# EAGLE design miniframeV3STABLE (EAGLE 5.10)
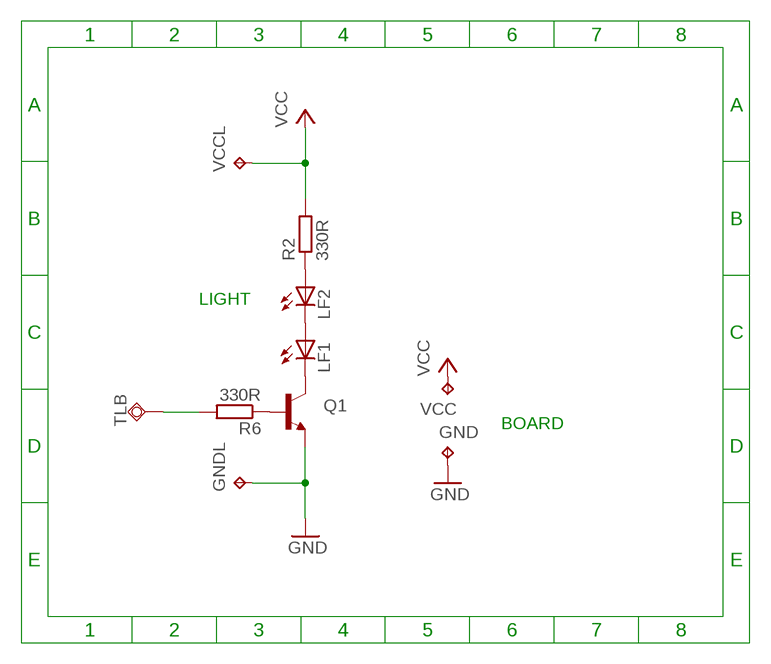
[diagram p0: schematic, sheet 1]

## Parts
GND  TPTP20SQ  [TP20SQ]
GNDL  TPTP20SQ  [TP20SQ]
LF1  LEDCHIPLED_1206  [CHIPLED_1206]
LF2  LEDCHIPLED_1206  [CHIPLED_1206]
Q1  TRANSISTOR_NPNSOT23-3  [SOT23-3]
R2  330R  R-EU_R0805  [R0805]
R6  330R  R-EU_R0805  [R0805]
TLB  TPSQTP19SQ  [TP19SQ]
VCC  TPTP20SQ  [TP20SQ]
VCCL  TPTP20SQ  [TP20SQ]

## Nets
GND: GND.TP GNDL.TP Q1.2(E)
N$1: R6.2 TLB.TP
N$4: LF1.A LF2.C
N$5: LF1.C Q1.3(C)
N$6: LF2.A R2.1
N$7: Q1.1(B) R6.1
VCC: R2.2 VCC.TP VCCL.TP

## Notes on the sheet
- LIGHT
- BOARD

## Library data of the parts
GND GNDL VCC VCCL = testpad:TP: Test pad
LF1 LF2 = led:LED: LED OSRAM: - CHIPLED LG R971, LG N971, LY N971, LG Q971, LY Q971, LO R971, LY R971 LH N974, LH R974 LS Q976, LO Q976, LY Q976 LO Q996 - Hyper CHIPLED LW Q18S LB Q993, LB Q99A, LB R99A - SideLED LS A670, LO A670, LY A670, LG A670, LP A670 LB A673, LV A673, LT A673, LW A673 LH A674 LY A675 LS A676, LA A676, LO A676, LY A676, LW A676 LS A679, LY A679, LG A679 - Hyper Micro SIDELED® LS Y876, LA Y876, LO Y876, LY Y876 LT Y87S - SmartLED LW L88C, LW L88S LB L89C, LB L89S, LG L890 LS L89K, LO L89K, LY L89K LS L896, LA L896, LO L896, LY L896 - TOPLED LS T670, LO T670, LY T670, LG T670, LP T670 LSG T670, LSP T670, LSY T670, LOP T670, LYG T670 LG T671, LOG T671, LSG T671 LB T673, LV T673, LT T673, LW T673 LH T674 LS T676, LA T676, LO T676, LY T676, LB T676, LH T676, LSB T676, LW T676 LB T67C, LV T67C, LT T67C, LS T67K, LO T67K, LY T67K, LW E67C LS E67B, LA E67B, LO E67B, LY E67B, LB E67C, LV E67C, LT E67C LW T67C LS T679, LY T679, LG T679 LS T770, LO T770, LY T770, LG T770, LP T770 LB T773, LV T773, LT T773, LW T773 LH T774 LS E675, LA E675, LY E675, LS T675 LS T776, LA T776, LO T776, LY T776, LB T776 LHGB T686 LT T68C, LB T68C - Hyper Mini TOPLED® LB M676 - Mini TOPLED Santana® LG M470 LS M47K, LO M47K, LY M47K Source: http://www.osram.convergy.de LUXEON: - LUMILED® LXK2-PW12-R00, LXK2-PW12-S00, LXK2-PW14-U00, LXK2-PW14-V00 LXK2-PM12-R00, LXK2-PM12-S00, LXK2-PM14-U00 LXK2-PE12-Q00, LXK2-PE12-R00, LXK2-PE12-S00, LXK2-PE14-T00, LXK2-PE14-U00 LXK2-PB12-K00, LXK2-PB12-L00, LXK2-PB12-M00, LXK2-PB14-N00, LXK2-PB14-P00, LXK2-PB14-Q00 LXK2-PR12-L00, LXK2-PR12-M00, LXK2-PR14-Q00, LXK2-PR14-R00 LXK2-PD12-Q00, LXK2-PD12-R00, LXK2-PD12-S00 LXK2-PH12-R00, LXK2-PH12-S00 LXK2-PL12-P00, LXK2-PL12-Q00, LXK2-PL12-R00 Source: www.luxeon.com KINGBRIGHT: KA-3528ASYC Source: www.kingbright.com
Q1 = SparkFun:TRANSISTOR_NPN: Transistor NPN BJT configuration in SOT23 package. MMBT2222 is the common NPN we use. Double check BCE configuration again layout.
R2 R6 = rcl:R-EU_: RESISTOR, European symbol
TLB = testpad:TPSQ: Test pad

## Board
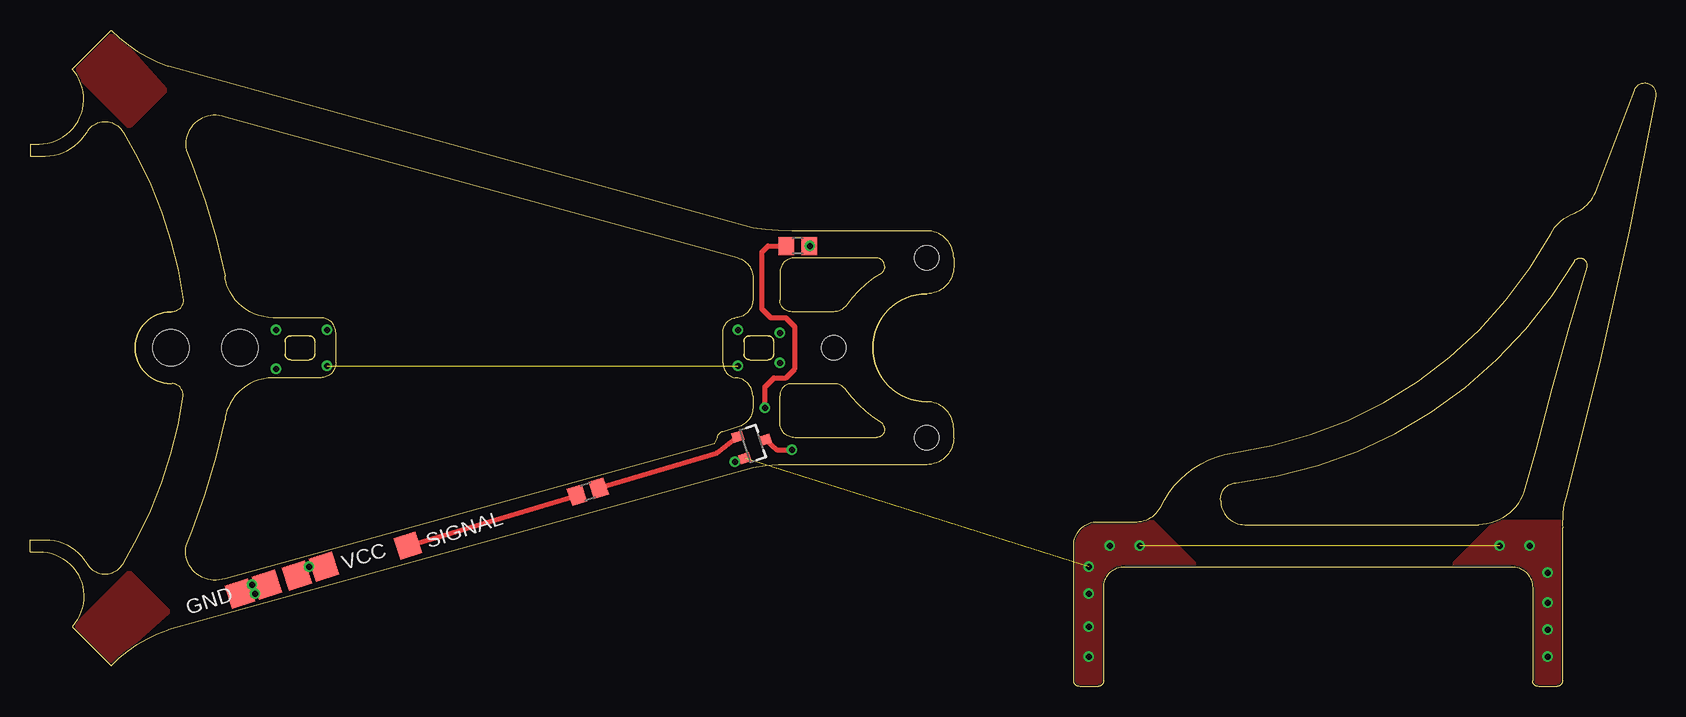
[diagram p1: board, top side]
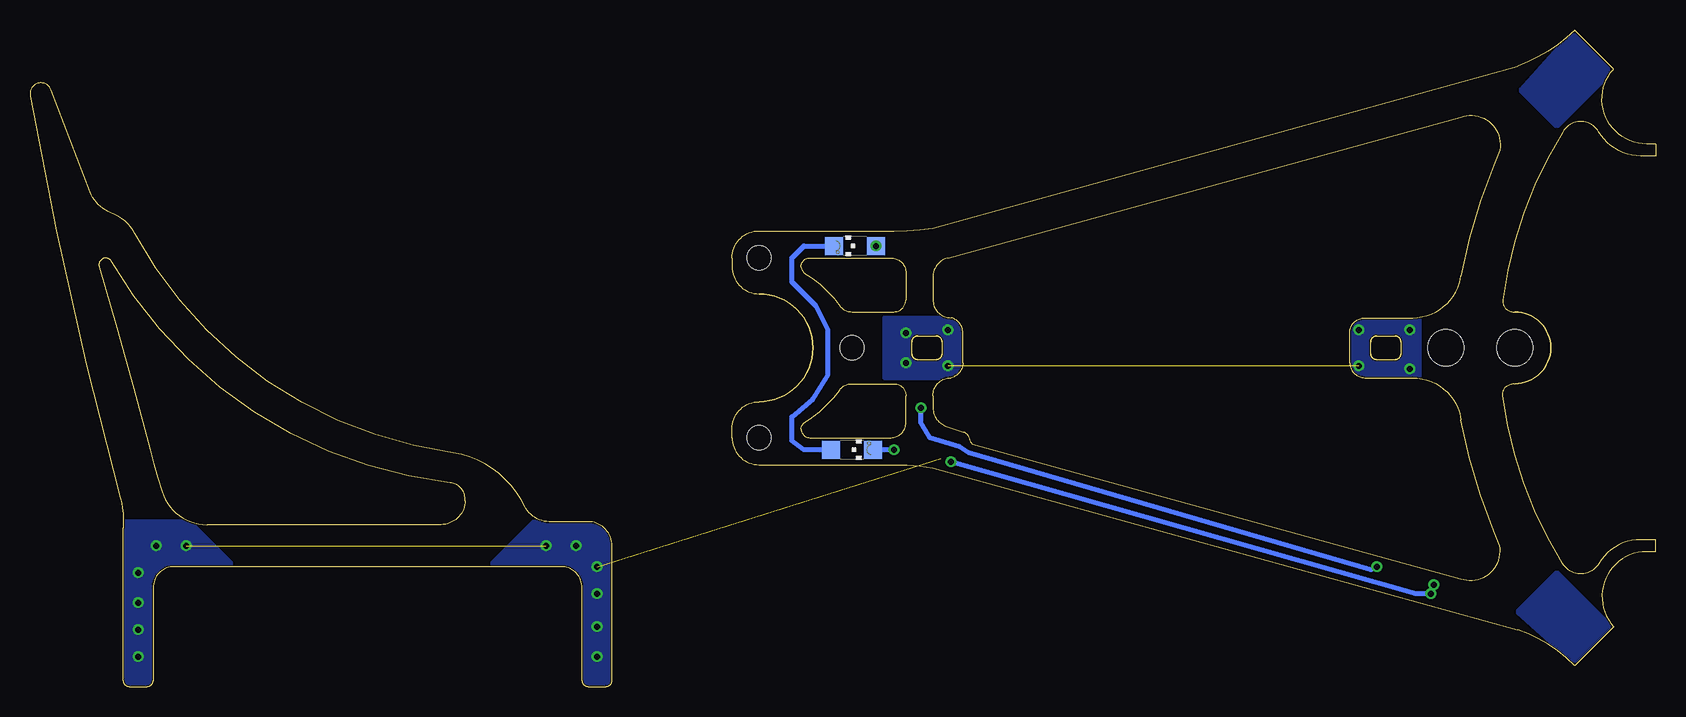
[diagram p2: board, bottom side, seen from below]

Size 135.52 x 54.75 mm. Coordinates in mm from the lower left corner, seen from the top.
Outline: 11.75,25.25 arc-103 12.75,24.25 arc-24 7.75,10.25 arc-119 4.75,10.25 arc59 1.25,12.25 0.75,12.25 0,12.25 0,11.25 0.75,11.25 arc-133 3.5,5 6.75,1.75 arc-25 11.5,4.75 60.25,18.25 arc-9 63.5,18.5 74.75,18.5 arc90 77,20.75 77,21.5 arc90 74.75,23.75
Outline: 4.75,46.25 arc-119 7.75,46.25
Outline: 11.75,31.25 arc180 11.75,25.25
Outline: 74.75,32.75 arc180 74.75,23.75
Outline: 59.5,27.75 arc90 60,27.25
Outline: 61.5,27.25 arc90 62,27.75
Outline: 62,28.75 arc90 61.5,29.25
Outline: 60,29.25 arc90 59.5,28.75
Outline: 21.25,27.75 arc90 21.75,27.25
Outline: 23.25,27.25 arc90 23.75,27.75
Outline: 23.75,28.75 arc90 23.25,29.25
Outline: 21.75,29.25 arc90 21.25,28.75
Outline: 59.5,28.75 arc-90 60,29.25
Outline: 61.5,29.25 arc-90 62,28.75
Outline: 62,27.75 arc-90 61.5,27.25
Outline: 60,27.25 arc-90 59.5,27.75
Outline: 21.25,28.75 arc-90 21.75,29.25
Outline: 23.25,29.25 arc-90 23.75,28.75
Outline: 23.75,27.75 arc-90 23.25,27.25
Outline: 21.75,27.25 arc-90 21.25,27.75
Outline: 4.75,46.25 arc-119 7.75,46.25
Outline: 7.75,46.25 arc-24 12.75,32.25
Outline: 12.75,32.25 arc-103 11.75,31.25
Outline: 11.75,25.25 arc-180 11.75,31.25
Outline: 74.75,23.75 arc-180 74.75,32.75
Outline: 16.25,47.5 arc120 13,44.75
Outline: 13.5,43.5 arc-10 16.25,34.25
Outline: 16.25,34.25 arc13 16.5,33.25 arc66 20.25,30.75 24.25,30.75 arc-90 25.5,29.5 25.5,27 arc-90 24.25,25.75 20.25,25.75 arc66 16.5,23.25 arc13 16.25,22.25 arc-10 13.5,13 13,11.75 arc120 16.25,9 57,20.25 arc25 57.25,20.75 arc-62 57.75,21.25 arc8 59.25,21.75 arc67 60.25,23.25 60.25,24.25 arc90 58.75,25.75 arc-77 57.75,27 57.75,29.5 arc-77 58.75,30.75 arc90 60.25,32.25 60.25,34.25 arc70 59,35.75 16.25,47.5
Outline: 59.5,28.75 arc-90 60,29.25
Outline: 61.5,29.25 arc-90 62,28.75
Outline: 62,27.75 arc-90 61.5,27.25
Outline: 60,27.25 arc-90 59.5,27.75
Outline: 21.25,28.75 arc-90 21.75,29.25
Outline: 23.25,29.25 arc-90 23.75,28.75
Outline: 23.75,27.75 arc-90 23.25,27.25
Outline: 21.75,27.25 arc-90 21.25,27.75
Outline: 59.5,27.75 arc90 60,27.25
Outline: 60,27.25 61.5,27.25
Outline: 61.5,27.25 arc90 62,27.75
Outline: 62,27.75 62,28.75
Outline: 62,28.75 arc90 61.5,29.25
Outline: 61.5,29.25 60,29.25
Outline: 60,29.25 arc90 59.5,28.75
Outline: 59.5,28.75 59.5,27.75
Outline: 21.25,27.75 arc90 21.75,27.25
Outline: 21.75,27.25 23.25,27.25
Outline: 23.25,27.25 arc90 23.75,27.75
Outline: 23.75,27.75 23.75,28.75
Outline: 23.75,28.75 arc90 23.25,29.25
Outline: 23.25,29.25 21.75,29.25
Outline: 21.75,29.25 arc90 21.25,28.75
Outline: 21.25,28.75 21.25,27.75
Outline: 74.75,32.75 arc90 77,35 77,35.75 arc90 74.75,38 63.5,38 arc-9 60.25,38.25 11.5,51.75 arc-25 6.75,54.75 3.5,51.5 arc-133 0.75,45.25 0,45.25 0,44.25 0.75,44.25 1.25,44.25 arc59 4.75,46.25
Outline: 4.75,46.25 arc-119 7.75,46.25
Outline: 7.75,46.25 arc-24 12.75,32.25
Outline: 16.25,47.5 arc120 13,44.75
Outline: 13,44.75 13.5,43.5
Outline: 13.5,43.5 arc-10 16.25,34.25
Outline: 71.25,21.5 arc37 71,22 arc-23 68,24.75 arc58 67,25.25 63.5,25.25 arc90 62.5,24.25 62.5,22 arc90 63.75,20.75 70.5,20.75 arc90 71.25,21.5
Outline: 71.25,35 arc-37 71,34.5 arc23 68,31.75 arc-58 67,31.25 63.5,31.25 arc-90 62.5,32.25 62.5,34.5 arc-90 63.75,35.75 70.5,35.75 arc-90 71.25,35
Outline: 127.75,0.5 arc-90 127.25,0 125.75,0 arc-90 125.25,0.5 125.25,8.25 arc90 123.5,10 91.25,10 arc90 89.5,8.25 89.5,0.5 arc-90 89,0 87.5,0 arc-90 87,0.5 87,11.75 arc-90 89,13.75 92.25,13.75 arc64 94.25,15 arc-54 100.25,19.5 arc54 126.75,37.75 arc-41 128.75,39.5 arc48 130.5,41.25 133.75,49.75 arc-170 135.5,49.25 arc-5 128,15.75 arc16 127.75,14 arc0 127.75,13.25 127.75,0.5
Outline: 99.25,15.5 arc90 101.25,13.5 120.75,13.5 arc73 124.5,16.25 arc3 125.5,19.75 arc-2 129.75,35 arc160 128.75,35.5 arc-53 100.5,17 arc90 99.25,15.5
Copper layers (1*16): Top 0.035mm / dielectric 1.5mm / Bottom 0.035mm
Design rules "default *": minimum track width 10mil, minimum drill 24mil, track to track 8mil, track to pad 8mil, pad to pad 8mil, via to via 8mil, smd to smd 8mil, copper to edge 5mil, drill to drill 8mil, minimum pad ring 10mil, minimum via ring 8mil, stop-mask expansion 4mil, vias tented up to drill 14mil, thermal gap 10mil
Holes 3 mm at 11.75,28.25 17.5,28.25 17.5,28.25 11.75,28.25 17.5,28.25 17.5,28.25
Holes 2 mm at 74.75,20.75 67,28.25 67,28.25 74.75,35.75 67,28.25 67,28.25

### Footprints (pad centres in the part's own frame; a part is rotated, then mirrored left to right if it is on the bottom)
TP20SQ = smd 2 x 2: TP 0,0
CHIPLED_1206 = smd 1.5 x 1.5: A 0,-1.75; C 0,1.75
SOT23-3 = smd 0.8 x 0.9: 1 -0.95,-1; 2 0.95,-1; 3 0,1.1
R0805 = smd 1.3 x 1.5: 1 -0.95,0; 2 0.95,0
TP19SQ = smd 1.9 x 1.9: TP 0,0

### Placement (x,y rotation side)
GND  17.5,7.75 18 top
GNDL  19.75,8.5 18 top
LF1  67,19.75 270 bottom
LF2  66.75,36.75 90 bottom
Q1  60.25,20.25 288 top
R2  64,36.75 180 top
R6  46.5,16.25 198 top
TLB  31.5,11.75 18 top
VCC  22.25,9.25 18 top
VCCL  24.5,10 18 top

### Tracks (layer width: path | path; a pad name or v marks a point on that pad's centre or on a via)
GND  (via drill 0.5)  (2 unrouted)
  Top 0.406: v58.75,18.75 Q1.2 | v18.5,8.5 GNDL.TP | GND.TP v18.75,7.75
  Bottom 0.406: v58.75,18.75 20,7.75 v18.75,7.75 v18.5,8.5
  other vias: 92.5,11.75 90,11.75 88.25,10 88.25,7.75 88.25,5 88.25,2.5 122.5,11.75 125,11.75 126.5,9.5 126.5,7 126.5,4.75 126.5,2.5
  pour Bottom: 85,13.75 93.5,13.75 98.25,9 117.5,9 122.25,13.75 128.75,13.75 128.75,-0.75 85,-0.75
  pour Top: 85,13.75 93.5,13.75 98.25,9 117.5,9 122.25,13.75 128.75,13.75 128.75,-0.75 85,-0.75
N$1
  Top 0.406: TLB.TP R6.2
N$2
  pour Top: 3.75,5 6.5,7.75 8.25,9.5 11.5,6.25 6.75,2
  pour Top: 8.25,46.75 5.5,49.5 3.75,51.25 7,54.5 11.25,49.75
  pour Bottom: 8.25,46.75 5.5,49.5 3.75,51.25 7,54.5 11.25,49.75
  pour Bottom: 3.75,5 6.5,7.75 8.25,9.5 11.5,6.25 6.75,2
N$4
  Bottom 0.406: LF1.A 71,19.75 72,20.5 72,22.5 70.25,24 69,26 69,29.75 70,31.75 72,33.75 72,35.75 71,36.75 LF2.C
N$5  (via drill 0.5)
  Top 0.406: Q1.3 62.25,19.75 v63.5,19.75
  Bottom 0.406: v63.5,19.75 LF1.C
N$6  (via drill 0.5)
  Top 0.406: R2.1 LF2.A
  other vias: 65,36.75
N$7
  Top 0.406: R6.1 57.25,19.5 Q1.1
PLANO  (via drill 0.5)  (1 unrouted)
  other vias: 59,29.75 62.5,29.5 62.5,27 59,26.75 20.5,29.75 24.75,29.75 24.75,26.75 20.5,26.5
  pour Bottom: 19.75,30.75 19.75,25 26.75,25 26.75,31.75
  pour Bottom: 56.5,30.25 56.75,25.75 64.25,25.75 64.25,30.75 56.75,30.75
VCC  (via drill 0.5)
  Top 0.406: R2.2 61.5,36.75 61,36.25 61,31.5 61.75,30.75 63,30.75 63.75,30 63.75,26.5 63,25.75 62,25.75 61.25,25 v61.25,23.25 | VCC.TP v23.25,10 VCCL.TP
  Bottom 0.406: v61.25,23.25 61.25,22 60.5,20.75 58,20 57.25,19.5 23.75,9.75 v23.25,10

### Text on the board
tNames: SIGNAL